# EAGLE schematic MOTOR (EAGLE 9.5.2)
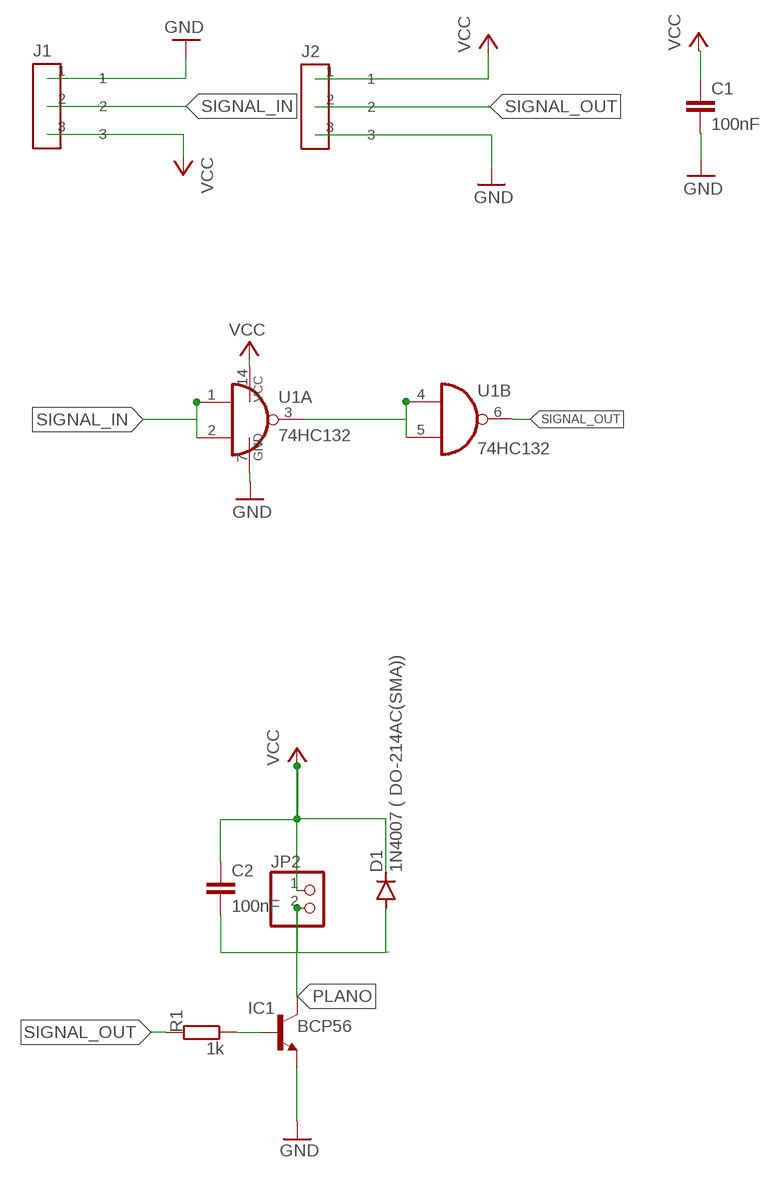
[diagram p0: schematic, sheet 1]

## Parts
C1  100nF  C-EUC0805  [C0805]
C2  100nF  C-EUC0805  [C0805]
D1  1N4007 ( DO-214AC(SMA))  GF1  [SMA-DO214AC]
IC1  BCP56  -NPN-SOT223  [SOT223]
J1  CONECTOR_MACHO  [3CONECTOR]
J2  CONECTOR_FEMEA  [3CONECTOR]
JP2  PINHD-1X2  [1X02]
R1  1k  R-EU_R0805W  [R0805W]
U1  74HC132  74HC00D  [SO14]

## Nets
GND: C1.2 IC1.3(E) J1.1 J2.3 U1.7(P:GND)
N$2: IC1.1(B) R1.1
N$3: U1.3(A:O) U1.4(B:I0) U1.5(B:I1)
PLANO: C2.2 D1.A IC1.4(C) JP2.2
SIGNAL_IN: J1.2 U1.1(A:I0) U1.2(A:I1)
SIGNAL_OUT: J2.2 R1.2 U1.6(B:O)
VCC: C1.1 C2.1 D1.K(C) J1.3 J2.1 JP2.1 U1.14(P:VCC)
Unconnected: U1.8(C:O) U1.9(C:I0) U1.10(C:I1) U1.11(D:O) U1.12(D:I0) U1.13(D:I1)

## Library data of the parts
C1 C2 = rcl:C-EU: CAPACITOR, European symbol; SPICEPREFIX: C
D1 = diode:GF1: DIODE
IC1 = transistor-neu-to92:*-NPN-: NPN Transistror
J1 = Eletroblocks Lib:CONECTOR_MACHO
J2 = Eletroblocks Lib:CONECTOR_FEMEA
JP2 = 1X02:90:PINHD-1X2: PIN HEADER
R1 = rcl:R-EU_: RESISTOR, European symbol; SPICEPREFIX: R
U1 = 74xx-eu:74*00: Quad 2-input NAND gate